# Altium schematic sheet Page11 PMIC.SchDoc
size 513 x 386 mm
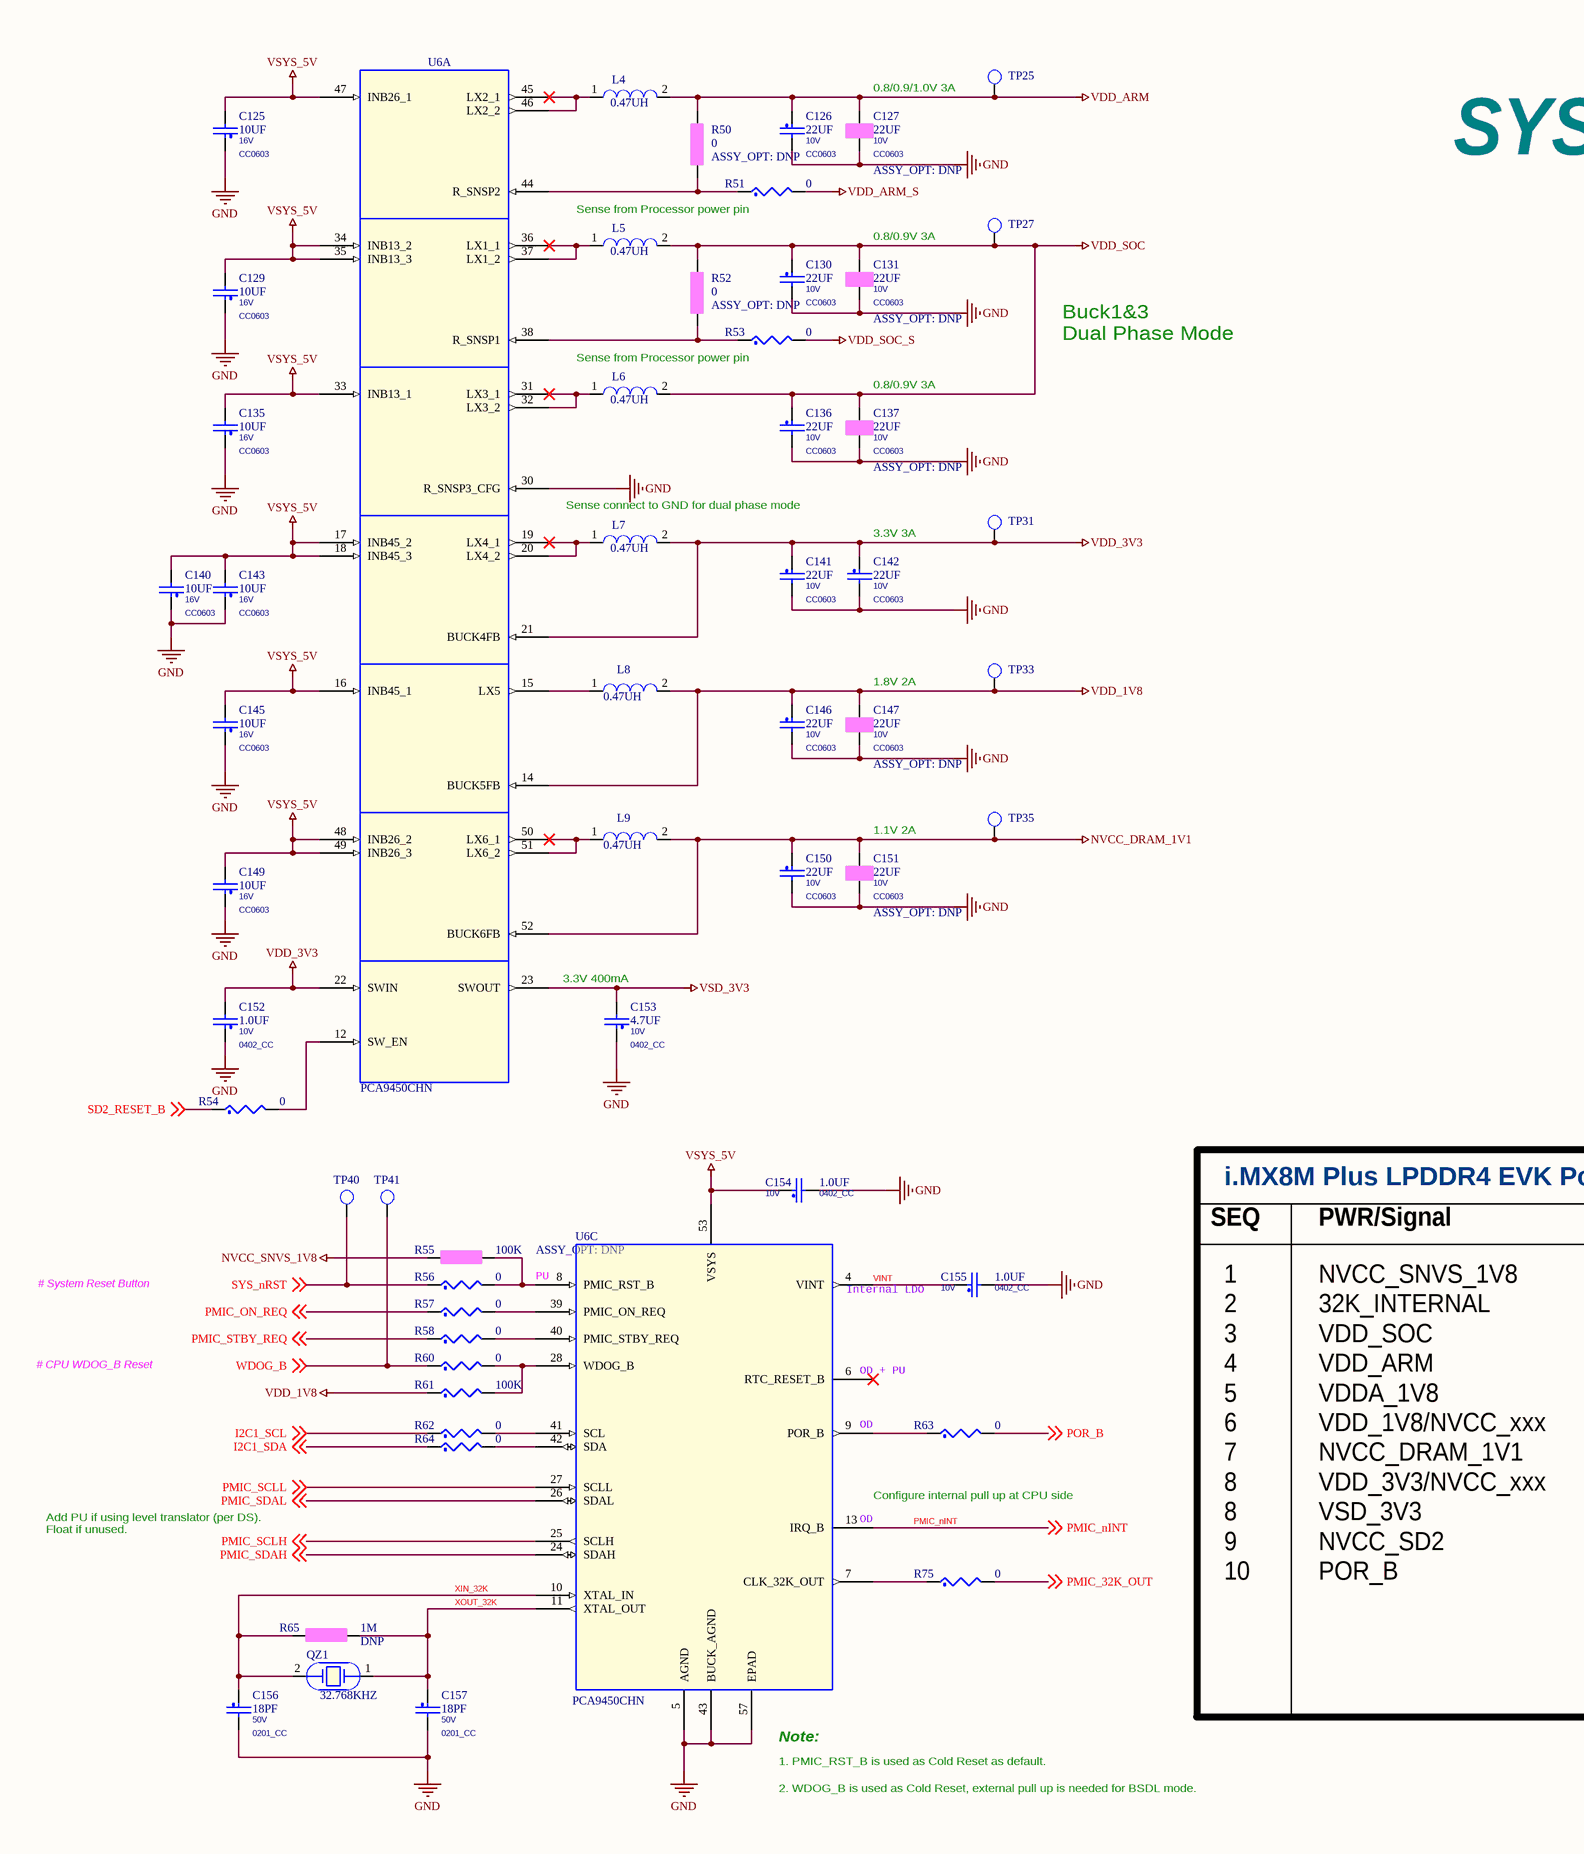
[diagram p0: Page11 PMIC.SchDoc, left]
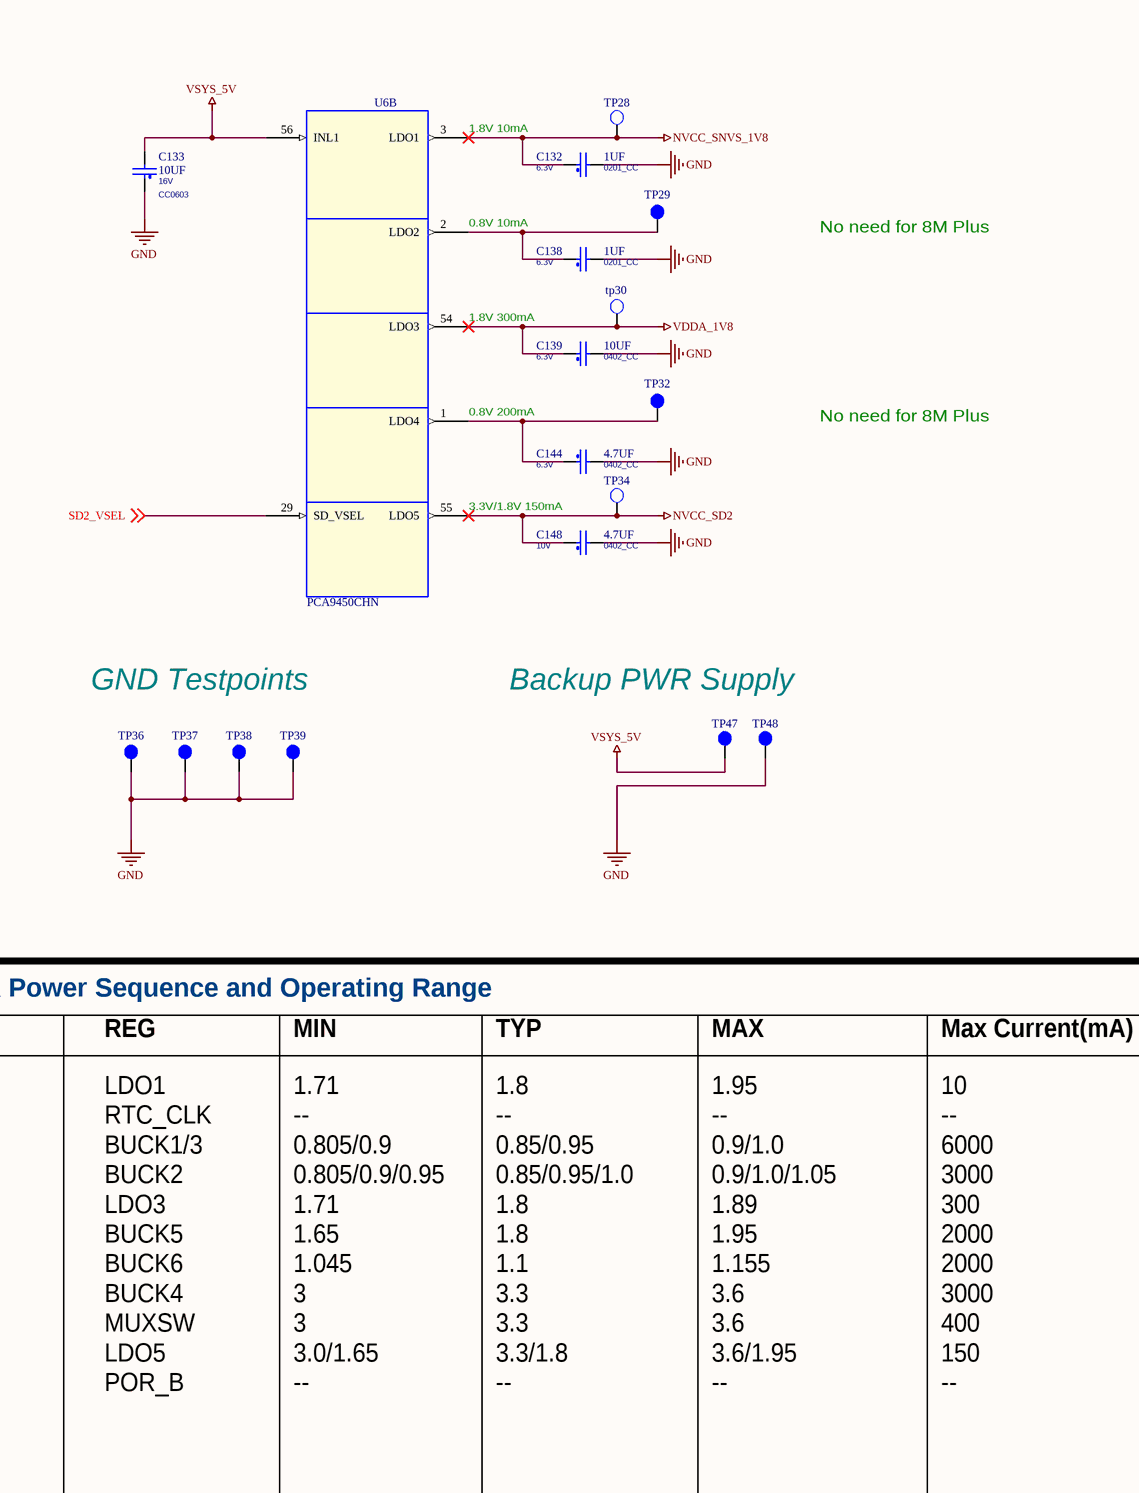
[diagram p1: Page11 PMIC.SchDoc, right]

## Parts
C125  10UF  VOLTAGE: 16V  [CC0603]
C126  22UF  VOLTAGE: 10V  [CC0603]
C127  22UF  ASSY_OPT: DNP  VOLTAGE: 10V  [CC0603]
C129  10UF  VOLTAGE: 16V  [CC0603]
C130  22UF  VOLTAGE: 10V  [CC0603]
C131  22UF  ASSY_OPT: DNP  VOLTAGE: 10V  [CC0603]
C132  1UF  VOLTAGE: 6.3V  [0201_CC]
C133  10UF  VOLTAGE: 16V  [CC0603]
C135  10UF  VOLTAGE: 16V  [CC0603]
C136  22UF  VOLTAGE: 10V  [CC0603]
C137  22UF  ASSY_OPT: DNP  VOLTAGE: 10V  [CC0603]
C138  1UF  VOLTAGE: 6.3V  [0201_CC]
C139  10UF  VOLTAGE: 6.3V  [0402_CC]
C140  10UF  VOLTAGE: 16V  [CC0603]
C141  22UF  VOLTAGE: 10V  [CC0603]
C142  22UF  VOLTAGE: 10V  [CC0603]
C143  10UF  VOLTAGE: 16V  [CC0603]
C144  4.7UF  voltage rating: 6.3V  [0402_CC]
C145  10UF  VOLTAGE: 16V  [CC0603]
C146  22UF  VOLTAGE: 10V  [CC0603]
C147  22UF  ASSY_OPT: DNP  VOLTAGE: 10V  [CC0603]
C148  4.7UF  VOLTAGE: 10V  [0402_CC]
C149  10UF  VOLTAGE: 16V  [CC0603]
C150  22UF  VOLTAGE: 10V  [CC0603]
C151  22UF  ASSY_OPT: DNP  VOLTAGE: 10V  [CC0603]
C152  1.0UF  VOLTAGE: 10V  [0402_CC]
C153  4.7UF  VOLTAGE: 10V  [0402_CC]
C154  1.0UF  VOLTAGE: 10V  [0402_CC]
C155  1.0UF  VOLTAGE: 10V  [0402_CC]
C156  18PF  VOLTAGE: 50V  [0201_CC]
C157  18PF  VOLTAGE: 50V  [0201_CC]
L4  0.47UH  [ind_sph2520]
L5  0.47UH  [ind_sph2520]
L6  0.47UH  [ind_sph2520]
L7  0.47UH  [ind_sph2520]
L8  0.47UH  [IND_2016A]
L9  0.47UH  [IND_2016A]
QZ1  32.768KHZ  [XTAL2-3P2X1P5-SM]
R50  0  ASSY_OPT: DNP  [0402_CC]
R51  0  [0402_CC]
R52  0  ASSY_OPT: DNP  [0402_CC]
R53  0  [0402_CC]
R54  0  [0402_CC]
R55  100K  ASSY_OPT: DNP  [0201_CC]
R56  0  [RC0402_25]
R57  0  [0402_CC]
R58  0  [0402_CC]
R60  0  [RC0402_25]
R61  100K  [0201_CC]
R62  0  [0402_CC]
R63  0  [0402_CC]
R64  0  [0402_CC]
R65  1M  ASSY_OPT: DNP  [0201_CC]
R75  0  [0402_CC]
TP25  TP_35MIL  [testpoint_35mil]  (value not drawn)
TP27  TP_35MIL  [testpoint_35mil]  (value not drawn)
TP28  TP_35MIL  [testpoint_35mil]  (value not drawn)
TP29  tpad_020  [tpad_020]  (value not drawn)
tp30  TP_35MIL  [testpoint_35mil]  (value not drawn)
TP31  TP_35MIL  [testpoint_35mil]  (value not drawn)
TP32  tpad_020  [tpad_020]  (value not drawn)
TP33  TP_35MIL  [testpoint_35mil]  (value not drawn)
TP34  TP_35MIL  [testpoint_35mil]  (value not drawn)
TP35  TP_35MIL  [testpoint_35mil]  (value not drawn)
TP36  TPAD_050  [TPAD_050]  (value not drawn)
TP37  TPAD_050  [TPAD_050]  (value not drawn)
TP38  TPAD_050  [TPAD_050]  (value not drawn)
TP39  TPAD_050  [TPAD_050]  (value not drawn)
TP40  TP_35MIL  [testpoint_35mil]  (value not drawn)
TP41  TP_35MIL  [testpoint_35mil]  (value not drawn)
TP47  TPAD_050  [TPAD_050]  (value not drawn)
TP48  TPAD_050  [TPAD_050]  (value not drawn)
U6  PCA9450CHN  [hvqfn56_0p4_7x7_ep4p7mm]  (parts A,B,C of 3)

## Nets
GND: C125.1 C126.2 C127.2 C129.1 C130.2 C131.2 C132.2 C133.1 C135.1 C136.2 C137.2 C138.2 C139.2 C140.1 C141.2 C142.2 C143.1 C144.2 C145.1 C146.2 C147.2 C148.2 C149.1 C150.2 C151.2 C152.1 C153.1 C154.2 C155.2 C156.2 C157.2 TP36.1(Pin1) TP37.1(Pin1) TP38.1(Pin1) TP39.1(Pin1) TP48.1(Pin1) U6.5(AGND) U6.30(R_SNSP3_CFG) U6.43(BUCK_AGND) U6.57(EPAD)
NVCC_DRAM_1V1: C150.1 C151.1 L9.2 TP35.1(TP) U6.52(BUCK6FB)
NVCC_SD2: C148.1 TP34.1(TP) U6.55(LDO5)
NVCC_SNVS_1V8: C132.1 R55.1 TP28.1(TP) U6.3(LDO1)
VDD_1V8: C146.1 C147.1 L8.2 R61.1 TP33.1(TP) U6.14(BUCK5FB)
VDD_3V3: C141.1 C142.1 C152.2 L7.2 TP31.1(TP) U6.21(BUCK4FB) U6.22(SWIN)
VDD_ARM: C126.1 C127.1 L4.2 R50.1 TP25.1(TP)
VDD_ARM_S: R51.2
VDD_SOC: C130.1 C131.1 C136.1 C137.1 L5.2 L6.2 R52.1 TP27.1(TP)
VDD_SOC_S: R53.2
VDDA_1V8: C139.1 tp30.1(TP) U6.54(LDO3)
VSD_3V3: C153.2 U6.23(SWOUT)
VSYS_5V: C125.2 C129.2 C133.2 C135.2 C140.2 C143.2 C145.2 C149.2 C154.1 TP47.1(Pin1) U6.16(INB45_1) U6.17(INB45_2) U6.18(INB45_3) U6.33(INB13_1) U6.34(INB13_2) U6.35(INB13_3) U6.47(INB26_1) U6.48(INB26_2) U6.49(INB26_3) U6.53(VSYS) U6.56(INL1)
I2C1_SCL: R62.1 ; off-sheet I2C1_SCL
I2C1_SDA: R64.1 ; off-sheet I2C1_SDA
PMIC_32K_OUT: R75.2 ; off-sheet PMIC_32K_OUT
PMIC_nINT: U6.13(IRQ_B) ; off-sheet PMIC_nINT
PMIC_ON_REQ: R57.1 ; off-sheet PMIC_ON_REQ
PMIC_SCLH: U6.25(SCLH) ; off-sheet PMIC_SCLH
PMIC_SCLL: U6.27(SCLL) ; off-sheet PMIC_SCLL
PMIC_SDAH: U6.24(SDAH) ; off-sheet PMIC_SDAH
PMIC_SDAL: U6.26(SDAL) ; off-sheet PMIC_SDAL
PMIC_STBY_REQ: R58.1 ; off-sheet PMIC_STBY_REQ
POR_B: R63.2 ; off-sheet POR_B
SD2_RESET_B: R54.1 ; off-sheet SD2_RESET_B
SD2_VSEL: U6.29(SD_VSEL) ; off-sheet SD2_VSEL
SYS_nRST: R56.1 TP40.1(TP) ; off-sheet SYS_nRST
VINT: C155.1 U6.4(VINT)
WDOG_B: R60.1 TP41.1(TP) ; off-sheet WDOG_B
XIN_32K: C156.1 QZ1.2 R65.1 U6.10(XTAL_IN)
XOUT_32K: C157.1 QZ1.1 R65.2 U6.11(XTAL_OUT)
NetC138_1: C138.1 TP29.1(Pin1) U6.2(LDO2)
NetC144_1: C144.1 TP32.1(Pin1) U6.1(LDO4)
NetL4_1: L4.1 U6.45(LX2_1) U6.46(LX2_2)
NetL5_1: L5.1 U6.36(LX1_1) U6.37(LX1_2)
NetL6_1: L6.1 U6.31(LX3_1) U6.32(LX3_2)
NetL7_1: L7.1 U6.19(LX4_1) U6.20(LX4_2)
NetL8_1: L8.1 U6.15(LX5)
NetL9_1: L9.1 U6.50(LX6_1) U6.51(LX6_2)
NetR50_2: R50.2 R51.1 U6.44(R_SNSP2)
NetR52_2: R52.2 R53.1 U6.38(R_SNSP1)
NetR54_2: R54.2 U6.12(SW_EN)
NetR55_2: R55.2 R56.2 U6.8(PMIC_RST_B)
NetR57_2: R57.2 U6.39(PMIC_ON_REQ)
NetR58_2: R58.2 U6.40(PMIC_STBY_REQ)
NetR60_2: R60.2 R61.2 U6.28(WDOG_B)
NetR62_2: R62.2 U6.41(SCL)
NetR63_1: R63.1 U6.9(POR_B)
NetR64_2: R64.2 U6.42(SDA)
NetR75_1: R75.1 U6.7(CLK_32K_OUT)

Not connected (* = marked no-connect by the designer): U6 6(RTC_RESET_B)*

## Notes on the sheet
- 0.8/0.9/1.0V 3A
- Sense from Processor power pin
- SYS PMIC
- (near C131) 0.8/0.9V 3A
- Buck1&3
  Dual Phase Mode
- (near U6) 1.8V 10mA
- (near C137) 0.8/0.9V 3A
- (near U6) 0.8V 10mA
- No need for 8M Plus
- (near L7) Sense connect to GND for dual phase mode
- (near C142) 3.3V 3A
- 1.8V 300mA
- (near U6) 0.8V 200mA
- (near C147) 1.8V 2A
- 3.3V/1.8V 150mA
- (near C151) 1.1V 2A
- GND Testpoints
- Backup PWR Supply
- (near C153) 3.3V 400mA
- SEQ
- i.MX8M Plus LPDDR4 EVK Power Sequence and Operating Range
- PWR/Signal
- REG
- MIN
- TYP
- MAX
- Max Current(mA)
- # System Reset Button
- (near U6) PU
- (near U6) Internal LDO
- # CPU WDOG_B Reset
- (near U6) OD + PU
- (near U6) OD
- Configure internal pull up at CPU side
- Add PU if using level translator (per DS).
  Float if unused.
- 1
  2
  3
  4
  5
  6
  7
  8
  8
  9
  10
- NVCC_SNVS_1V8
  32K_INTERNAL
  VDD_SOC
  VDD_ARM
  VDDA_1V8
  VDD_1V8/NVCC_xxx
  NVCC_DRAM_1V1
  VDD_3V3/NVCC_xxx
  VSD_3V3
  NVCC_SD2
  POR_B
- LDO1
  RTC_CLK
  BUCK1/3
  BUCK2
  LDO3
  BUCK5
  BUCK6
  BUCK4
  MUXSW
  LDO5
  POR_B
- 1.71
  --
  0.805/0.9
  0.805/0.9/0.95
  1.71
  1.65
  1.045
  3
  3
  3.0/1.65
  --
- 1.8
  --
  0.85/0.95
  0.85/0.95/1.0
  1.8
  1.8
  1.1
  3.3
  3.3
  3.3/1.8
  --
- 1.95
  --
  0.9/1.0
  0.9/1.0/1.05
  1.89
  1.95
  1.155
  3.6
  3.6
  3.6/1.95
  --
- 10
  --
  6000
  3000
  300
  2000
  2000
  3000
  400
  150
  --
- 1. PMIC_RST_B is used as Cold Reset as default.
- (near U6) Note:
- 2. WDOG_B is used as Cold Reset, external pull up is needed for BSDL mode.

## Library data of the parts
C125 C133 = CAP_NP: CAP CER 10.0uF 16V 10% X5R 0603; CLASS: DISCRETE; Temp Range: -55¡ãC to +85¡ãC; FPLIST: CC0603_OV,CC0603,0603_CC,cc0603_0805_nsp; CAD_APPROVED: Yes; MFG_PN01: GRM188R61C106KAALD; MFG_NAME01: MURATA; AGILE_PN: 150-80060; Package Type: SMT; Package Size: 0603; HEIGHT: 0.9MM; Temp_Range: -55¡ãC to +85¡ãC; ROHS: Yes; Tolerance: 10%; PCB Footprint: CC0603
C126 C136 C141 C146 C150 = CAP_NP: CAP CER 22uF 10V 20% X5R 0603; CLASS: DISCRETE; FPLIST: CC0603_OV,CC0603,0603_CC; CAD_APPROVED: Yes; MFG_PN01: C1608X5R1A226M080AC; MFG_NAME01: TDK; AGILE_PN: 150-79530; WVDC: 6.3V; SIGNAL_MODEL: DEFAULT_CAPACITOR_2.2e+07pF_2_1; HEIGHT: 1MM; ROHS: Yes; Tolerance: 20%; Package Size: 0603; PCB Footprint: CC0603
C127 C131 C147 = CAP_NP: CAP CER 22uF 10V 20% X5R 0603; CLASS: DISCRETE; SIGNAL_MODEL: DEFAULT_CAPACITOR_2.2e+07pF_2_1; FPLIST: CC0603_OV,CC0603,0603_CC; CAD_APPROVED: Yes; MFG_PN01: C1608X5R1A226M080AC; MFG_NAME01: TDK; AGILE_PN: 150-79530; WVDC: 6.3V; HEIGHT: 1MM; ROHS: Yes; Tolerance: 20%; Package Size: 0603; PCB Footprint: CC0603
C129 C135 C140 = CAP_NP: CAP CER 10.0uF 16V 10% X5R 0603; CLASS: DISCRETE; Temp Range: -55¡ãC to +85¡ãC; AGILE_PN: 150-80060; MFG_NAME01: MURATA; MFG_PN01: GRM188R61C106KAALD; CAD_APPROVED: Yes; FPLIST: CC0603_OV,CC0603,0603_CC,cc0603_0805_nsp; Package Type: SMT; Package Size: 0603; Tolerance: 10%; ROHS: Yes; Temp_Range: -55¡ãC to +85¡ãC; HEIGHT: 0.9MM; PCB Footprint: CC0603
C130 = CAP_NP: CAP CER 22uF 10V 20% X5R 0603; CLASS: DISCRETE; SIGNAL_MODEL: DEFAULT_CAPACITOR_2.2e+07pF_2_1; WVDC: 6.3V; AGILE_PN: 150-79530; MFG_NAME01: TDK; MFG_PN01: C1608X5R1A226M080AC; CAD_APPROVED: Yes; FPLIST: CC0603_OV,CC0603,0603_CC; Tolerance: 20%; ROHS: Yes; HEIGHT: 1MM; Package Size: 0603; PCB Footprint: CC0603
C132 = CAP_NP: CAP CER 1uF 6.3V 20% X5R 0201; CLASS: DISCRETE; AGILE_PN: 150-79407; MFG_NAME01: AVX; MFG_PN01: 02016D105MAT2A; CAD_APPROVED: Yes; FPLIST: CC0201,CC0201_HD,0201_CC,0201_CC_012SM_NSP; Tolerance: 20%; ROHS: Yes; HEIGHT: 0.35MM; PCB Footprint: 0201_CC; Package Size: 0201; Package Type: 7¡± reel
C137 C142 C151 = CAP_NP: CAP CER 22uF 10V 20% X5R 0603; CLASS: DISCRETE; WVDC: 6.3V; AGILE_PN: 150-79530; MFG_NAME01: TDK; MFG_PN01: C1608X5R1A226M080AC; CAD_APPROVED: Yes; FPLIST: CC0603_OV,CC0603,0603_CC; SIGNAL_MODEL: DEFAULT_CAPACITOR_2.2e+07pF_2_1; Tolerance: 20%; ROHS: Yes; HEIGHT: 1MM; Package Size: 0603; PCB Footprint: CC0603
C138 = CAP_NP: CAP CER 1uF 6.3V 20% X5R 0201; CLASS: DISCRETE; FPLIST: CC0201,CC0201_HD,0201_CC,0201_CC_012SM_NSP; CAD_APPROVED: Yes; MFG_PN01: 02016D105MAT2A; MFG_NAME01: AVX; AGILE_PN: 150-79407; HEIGHT: 0.35MM; ROHS: Yes; Tolerance: 20%; PCB Footprint: 0201_CC; Package Size: 0201; Package Type: 7¡± reel
C139 = CAP_NP: CAP CER 10UF 6.3V 20% X5R 0402; CLASS: DISCRETE; FPLIST: CC0402_25,CC0402_HD,0402_CC; CAD_APPROVED: Yes; MFG_PN01: CL05A106MQ5NUNC; MFG_NAME01: SAMSUNG ELECTRO MECHANICS; AGILE_PN: 150-79163; HEIGHT: 0.65 MM; ROHS: Yes; Tolerance: 20%; PCB Footprint: 0402_CC
C143 C145 C149 = CAP_NP: CAP CER 10.0uF 16V 10% X5R 0603; CLASS: DISCRETE; FPLIST: CC0603_OV,CC0603,0603_CC,cc0603_0805_nsp; CAD_APPROVED: Yes; Temp_Range: -55¡ãC to +85¡ãC; MFG_PN01: GRM188R61C106KAALD; MFG_NAME01: MURATA; AGILE_PN: 150-80060; HEIGHT: 0.9MM; ROHS: Yes; Tolerance: 10%; Package Size: 0603; Package Type: SMT; Temp Range: -55¡ãC to +85¡ãC; PCB Footprint: CC0603
C144 = CAP_NP: CAP CER 4.7UF 6.3V 20% X5R 0402; CLASS: DISCRETE; FPLIST: CC0402_25,CC0402_HD,0402_CC; CAD_APPROVED: Yes; MFG_PN01: C1005X5R0J475M050BC; MFG_NAME01: TDK; AGILE_PN: 150-78463; PCB Footprint: 0402_CC; HEIGHT: 0.65MM; ROHS: Yes; Tolerance: 20%; VOLTAGE: 6.3V
C148 = CAP_NP: CAP CER 4.7uF 10V 10% X5R 0402; CLASS: DISCRETE; FPLIST: CC0402_25,CC0402_HD,0402_CC; CAD_APPROVED: Yes; MFG_PN01: CL05A475KP5NRNC; MFG_NAME01: Samsung Electro Mechanics; AGILE_PN: 150-80044; HEIGHT: 0.65MM; ROHS: Yes; Tolerance: 10%; PCB Footprint: 0402_CC
C152 C154 C155 = CAP_NP: CAP CER 1.0UF 10V 10% X5R 0402; CLASS: DISCRETE; AGILE_PN: 150-75772; MFG_NAME01: YAGEO AMERICA; MFG_PN01: CC0402KRX5R6BB105; CAD_APPROVED: Yes; FPLIST: CC0402_25,CC0402_HD,0402_CC; ROHS: Yes; HEIGHT: 0.6MM; PCB Footprint: 0402_CC; Package Size: 0402
C153 = CAP_NP: CAP CER 4.7uF 10V 10% X5R 0402; CLASS: DISCRETE; AGILE_PN: 150-80044; MFG_NAME01: Samsung Electro Mechanics; MFG_PN01: CL05A475KP5NRNC; CAD_APPROVED: Yes; FPLIST: CC0402_25,CC0402_HD,0402_CC; Tolerance: 10%; ROHS: Yes; HEIGHT: 0.65MM; PCB Footprint: 0402_CC
C156 = CAP_NP: CAP CER 18pF 50V 5% C0G 0201; CLASS: DISCRETE; AGILE_PN: 150-79476; MFG_NAME01: MURATA; MFG_PN01: GRM0335C1H180JA01D; CAD_APPROVED: Yes; FPLIST: CC0201,CC0201_HD,0201_CC; Tolerance: 5%; ROHS: Yes; HEIGHT: 0.33MM; PCB Footprint: 0201_CC; Package Size: 0201; Package Type: &#966;180mm Paper taping
C157 = CAP_NP: CAP CER 18pF 50V 5% C0G 0201; CLASS: DISCRETE; FPLIST: CC0201,CC0201_HD,0201_CC; CAD_APPROVED: Yes; MFG_PN01: GRM0335C1H180JA01D; MFG_NAME01: MURATA; AGILE_PN: 150-79476; HEIGHT: 0.33MM; ROHS: Yes; Tolerance: 5%; PCB Footprint: 0201_CC; Package Size: 0201; Package Type: &#966;180mm Paper taping
L4-L7 = INDUCTOR: IND PWR 0.47uH@1MHZ 4.7A 20% SMT; PART_TYPE: INDUCTOR\POWER; CLASS: DISCRETE; CAD_APPROVED: Yes; Temp_Range: -40¡ãC to +125¡ãC; MFG_PN01: WPN252012ER47MT; MFG_NAME01: SHENZHEN SUNLORD ELECTRONICS CO., LTD; AGILE_PN: 180-78647; PCB Footprint: ind_sph2520; Tolerance: 20%; HEIGHT: 1.2MM; ROHS: Yes; TOL: 20%; Temp Range: -40¡ãC to +125¡ãC
L8 = INDUCTOR: IND PWR 0.47uH@1MHz 3.4A 20% 2016; PART_TYPE: INDUCTOR\POWER; CLASS: DISCRETE; AGILE_PN: 180-78995; MFG_NAME01: SHENZHEN SUNLORD ELECTRONICS CO., LTD; MFG_PN01: WPN201612HR47MT; Temp_Range: -40¡ãC to 125¡ãC; CAD_APPROVED: Yes; PCB Footprint: IND_2016A; Tolerance: 20%; ROHS: Yes; HEIGHT: 1.2MM; Package Size: 2x1.6x1.2 mm; Temp Range: -40¡ãC to 125¡ãC
L9 = INDUCTOR: IND PWR 0.47uH@1MHz 3.4A 20% 2016; PART_TYPE: INDUCTOR\POWER; CLASS: DISCRETE; CAD_APPROVED: Yes; Temp_Range: -40¡ãC to 125¡ãC; MFG_PN01: WPN201612HR47MT; MFG_NAME01: SHENZHEN SUNLORD ELECTRONICS CO., LTD; AGILE_PN: 180-78995; PCB Footprint: IND_2016A; HEIGHT: 1.2MM; ROHS: Yes; Tolerance: 20%; Package Size: 2x1.6x1.2 mm; Temp Range: -40¡ãC to 125¡ãC
QZ1 = XTAL: XTAL 32.768KHZ 12.5PF 20PPM 3.2X1.5MM SMT; CLASS: IC; CAD_APPROVED: Yes; MFG_PN01: ABS07-32.768KHZ-T; MFG_NAME01: Abracon Corporation; AGILE_PN: 230-77653; PCB Footprint: XTAL2-3P2X1P5-SM; HEIGHT: 0.9MM; ROHS: Yes
R50-R54 R56 = RES: RES MF ZERO OHM 1/16W 5% 0402; CLASS: DISCRETE; FPLIST: RC0402_25,RC0402_HD,RC0402_X2,0402_CC; CAD_APPROVED: Yes; MFG_PN01: MCR01MZPJ000; MFG_NAME01: ROHM; AGILE_PN: 470-75394; HEIGHT: 0.45 MM; ROHS: Yes; Tolerance: 5%; VOLTAGE: 1/16W
  R50-R54: PCB Footprint: 0402_CC
  R56: PCB Footprint: RC0402_25
R55 = RES: RES MF 100K 1/20W 1% 0201; CLASS: DISCRETE; FPLIST: RC0201,0201_CC; CAD_APPROVED: Yes; MFG_PN01: RC-0201-104FT; MFG_NAME01: SKYMOS; AGILE_PN: 470-77704; HEIGHT: 0.26MM; ROHS: Yes; Tolerance: 1%; PCB Footprint: 0201_CC
R57 R63 R75 = RES: RES MF ZERO OHM 1/16W 5% 0402; CLASS: DISCRETE; CAD_APPROVED: Yes; MFG_PN01: MCR01MZPJ000; MFG_NAME01: ROHM; AGILE_PN: 470-75394; HEIGHT: 0.45 MM; ROHS: Yes; Tolerance: 5%; PCB Footprint: 0402_CC; VOLTAGE: 1/16W
R58 R60 R62 R64 = RES: RES MF ZERO OHM 1/16W 5% 0402; CLASS: DISCRETE; AGILE_PN: 470-75394; MFG_NAME01: ROHM; MFG_PN01: MCR01MZPJ000; CAD_APPROVED: Yes; FPLIST: RC0402_25,RC0402_HD,RC0402_X2,0402_CC; Tolerance: 5%; ROHS: Yes; HEIGHT: 0.45 MM; VOLTAGE: 1/16W
  R58 R62 R64: PCB Footprint: 0402_CC
  R60: PCB Footprint: RC0402_25
R61 = RES: RES MF 100K 1/20W 1% 0201; CLASS: DISCRETE; AGILE_PN: 470-77704; MFG_NAME01: SKYMOS; MFG_PN01: RC-0201-104FT; CAD_APPROVED: Yes; FPLIST: RC0201,0201_CC; Tolerance: 1%; ROHS: Yes; HEIGHT: 0.26MM; PCB Footprint: 0201_CC
R65 = RES: RES MF 1.0M 1/20W 5% AEC-Q200 0201; CLASS: DISCRETE; FPLIST: RC0201,0201_CC; CAD_APPROVED: Yes; Temp_Range: 55¡ãC ~ 125¡ãC; MFG_PN01: ERJ-1GNJ105C; MFG_NAME01: PANASONIC; AGILE_PN: 470-79975; VOLTAGE: 25V; HEIGHT: 0.26MM; ROHS: Yes; Tolerance: 5%; PCB Footprint: 0201_CC; Temp Range: 55¡ãC ~ 125¡ãC
TP25 TP31 TP33-TP35 TP40 TP41 = T POINT R: TEST POINT PAD .035 SMT, no part to order; CLASS: IC; ASSY_OPT: DNP; CAD_APPROVED: Yes; AGILE_PN: 510-75618; HEIGHT: 0.1MM; ROHS: Yes; PCB Footprint: testpoint_35mil
TP27 TP28 tp30 = T POINT R: TEST POINT PAD .035 SMT, no part to order; CLASS: IC; ASSY_OPT: DNP; AGILE_PN: 510-75618; CAD_APPROVED: Yes; ROHS: Yes; HEIGHT: 0.1MM; PCB Footprint: testpoint_35mil
TP29 = TESTLOOP: TEST POINT PAD 0.5MM DIA SMT, NO PART TO ORDER; ASSY_OPT: DNP; CLASS: IO; CAD_APPROVED: Yes; AGILE_PN: 211-77484; HEIGHT: 0.1MM; ROHS: Yes; PCB Footprint: tpad_020
TP32 = TESTLOOP: TEST POINT PAD 0.5MM DIA SMT, NO PART TO ORDER; ASSY_OPT: DNP; CLASS: IO; AGILE_PN: 211-77484; CAD_APPROVED: Yes; ROHS: Yes; HEIGHT: 0.1MM; PCB Footprint: tpad_020
TP36 TP37 TP39 = TESTLOOP: TEST POINT PAD 50MIL DIA SMT, NO PART TO ORDER; ASSY_OPT: DNP; CLASS: IO; AGILE_PN: 211-76644; MFG_NAME01: NOTACOMPONENT; CAD_APPROVED: Yes; PCB Footprint: TPAD_050; MFG_PN01: NOTACOMPONENT; ROHS: Yes; HEIGHT: 0.1MM
TP38 = TESTLOOP: TEST POINT PAD 50MIL DIA SMT, NO PART TO ORDER; ASSY_OPT: DNP; CLASS: IO; CAD_APPROVED: Yes; MFG_PN01: NOTACOMPONENT; AGILE_PN: 211-76644; PCB Footprint: TPAD_050; HEIGHT: 0.1MM; ROHS: Yes; MFG_NAME01: NOTACOMPONENT
TP47 = TESTLOOP: TEST POINT PAD 50MIL DIA SMT, NO PART TO ORDER; ASSY_OPT: DNP; CLASS: IO; MFG_PN01: NOTACOMPONENT; CAD_APPROVED: Yes; AGILE_PN: 211-76644; MFG_NAME01: NOTACOMPONENT; ROHS: Yes; HEIGHT: 0.1MM; PCB Footprint: TPAD_050
TP48 = TESTLOOP: TEST POINT PAD 50MIL DIA SMT, NO PART TO ORDER; ASSY_OPT: DNP; CLASS: IO; AGILE_PN: 211-76644; CAD_APPROVED: Yes; MFG_NAME01: NOTACOMPONENT; HEIGHT: 0.1MM; ROHS: Yes; MFG_PN01: NOTACOMPONENT; PCB Footprint: TPAD_050
U6 = PCA9450_HVQFN56P_A: IC POWER MANAGEMENT 2.7-5.5V HVQFN56; SPLIT_INST: TRUE; SWAP_INFO: (S1+S2+S3); PRE_APN: 315-82348; Temp_Range: -40C to +105C; MFG_NAME01: NXP SEMICONDUCTORS; AGILE_PN: TMP-WF-36306; CLASS: IC; PCB Footprint: hvqfn56_0p4_7x7_ep4p7mm; HEIGHT: 1MM; ROHS: Yes; MFG_PN01: PCA9450CHN; VOLTAGE: 2.7-5.5V; Temp Range: -40C to +105C